# Altium schematic sheet 3EWL1-200001_05.SchDoc: Lantern LED Driver
size A4; Engineer: cronos; Revision: 6A1.0; SheetNumber: 5; SheetTotal: 5
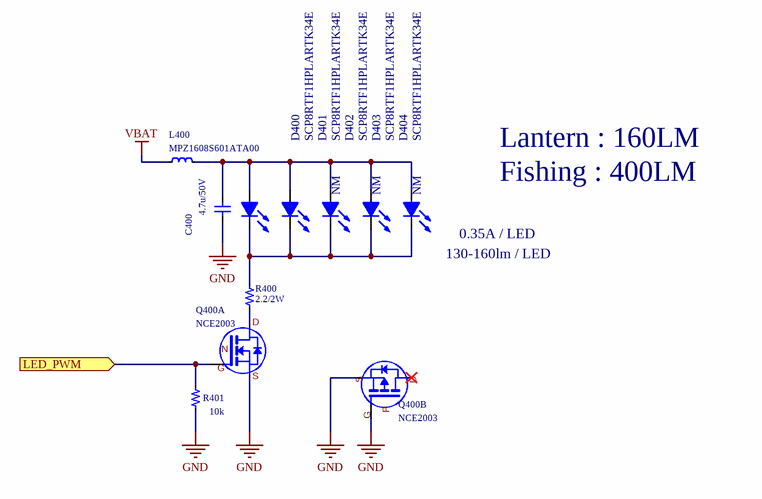
[diagram p0: 3EWL1-200001_05.SchDoc]

## Parts
C400  4.7u/50V  [SC2-3.20X1.60A]
D400  SCP8RTF1HPLARTK34E  [SCP8RTF1HPLARTK34E]
D401  SCP8RTF1HPLARTK34E  [SCP8RTF1HPLARTK34E]
D402  Mounting: NM  [SCP8RTF1HPLARTK34E]  (hidden comment: SCP8RTF1HPLARTK34E)
D403  Mounting: NM  [SCP8RTF1HPLARTK34E]  (hidden comment: SCP8RTF1HPLARTK34E)
D404  Mounting: NM  [SCP8RTF1HPLARTK34E]  (hidden comment: SCP8RTF1HPLARTK34E)
L400  MPZ1608S601ATA00  [SL2-1.60X0.80A]
Q400  NCE2003  [SOT23-6]  (parts A,B of 2)
R400  2.2/2W  [SR2-6.40x3.20A]
R401  10k  [SR2-1.00X0.50A]

## Ports
LED_PWM (in)

## Nets
GND: C400.1 Q400.2(P_S) Q400.3(P_G) Q400.5(N_S) R401.2
VBAT: L400.1
LED_PWM: Q400.1(N_G) R401.1 ; port LED_PWM
NetC400_2: C400.2 D400.A D401.A D402.A D403.A D404.A L400.2
NetD400_C: D400.C D401.C D402.C D403.C D404.C R400.1
NetQ400_6: Q400.6(N_D) R400.2

Not connected (* = marked no-connect by the designer): Q400 4(P_D)*

## Notes on the sheet
- Lantern : 160LM
- Fishing : 400LM
- (near D404) 130-160lm / LED
- (near D404) 0.35A / LED
- Model
- Title
- Rev.
- Size
- Filename
- Comment
- Date
- Design
- A4
- Sheet          of
- (in symbol NCE2003, part A) D; N; G; S
- (in symbol NCE2003, part B) S; D; P; G

## Library data of the parts
C400 = C: 4.7u/50V, X7R, 3216Size; Manufacturer: Murata; Manufacturer Part Number: GRM31CR71H475KA12L; Commodity: MLCC; Replace: OK; Mounting: *; Footprint(imperial): 1206; Footprint(metric): 3216; Value: 4.7u/50V
D400-D404 = Diode_LED: 2.75-3.4V, 315-363lm/A, 1919Size, SMT; Manufacturer: SAMSUNG; Commodity: LED; Replace: NG; Manufacturer Part Number: SCP8RTF1HPLARTK34E; Value: SCP8RTF1HPLARTK34E
  D400 D401: Mounting: *
L400 = L: 600ohm/1.0A/150mohm; Manufacturer: TDK; Commodity: RFC; Replace: OK; FirstPublished: 2012/10/14; LatestRevisionDate: *; LatestRevisionNote: *; PackageReference: *; Manufacturer Part Number: MPZ1608S601ATA00; Mounting: *; Footprint(imperial): '0603; Footprint(metric): 1608; Value: 600ohm/1.0A/150mohm
Q400 = NCE2003: N(20V, 55mohm, Vgs(th)=1.2V ), P(-20V, 100mohm, Vgs(th)=-1V), SOT23-6; Manufacturer: ncepower; Commodity: MOSFET; Replace: OK; Mounting: *; Manufacturer Part Number: NCE2003; Value: NCE2003
R400 = R: 2.2, 2W, 6432Size; Manufacturer: EverOhms; Manufacturer Part Number: CRH2512F2R20E04Z; Description 1: Resistor; Replace: OK; FirstPublished: 2012/10/14; LatestRevisionDate: *; LatestRevisionNote: *; PackageReference: *; Mounting: *; Description 2: *; Value: 2.2/2W; Commodity: Resistor; Footprint(imperial): 2512; Footprint(metric): 6432
R401 = R: Manufacturer: YAGEO; Manufacturer Part Number: RC0402FR-0710KL; Description 1: Resistor; Replace: OK; FirstPublished: 2012/10/14; LatestRevisionDate: *; LatestRevisionNote: *; PackageReference: *; Mounting: *; Description 2: *; Value: 10k; Commodity: Resistor; Footprint(imperial): 0402; Footprint(metric): 1005